# Altium schematic sheet SENSOR.SchDoc
size A; SheetNumber: 7; SheetTotal: 10
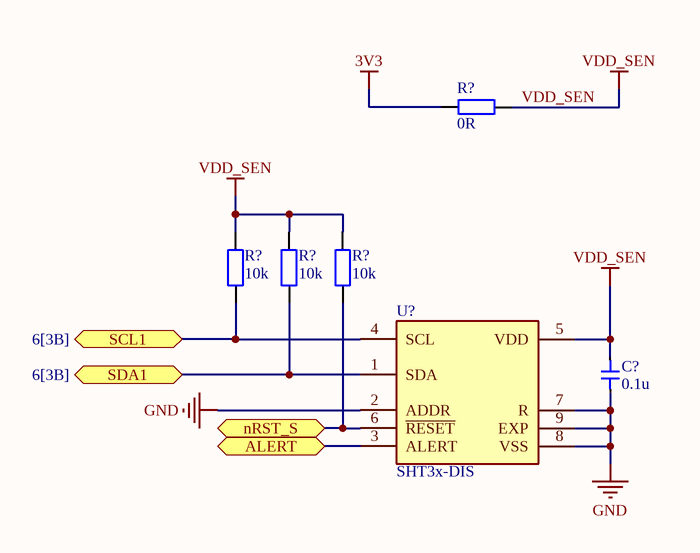
[diagram p0: SENSOR.SchDoc]

## Parts
(Parts that share a designator on the sheet are numbered #1, #2 ... from top to bottom, then left to right.)
C?  0.1u  [Cap 0603]
R?#1  0R  [tro smd 0603]
R?#2  10k  [tro smd 0603]
R?#3  10k  [tro smd 0603]
R?#4  10k  [tro smd 0603]
U?  SHT3x-DIS  [SHT3x]

## Ports
ALERT (bidir), nRST_S (bidir), SCL1 (bidir, see 6[3B]), SDA1 (bidir, see 6[3B])

## Nets
3V3: R?#1.1
GND: C?.2 U?.2(ADDR) U?.7(R) U?.8(VSS) U?.9(EXP)
VDD_SEN: C?.1 R?#1.2 R?#2.1 R?#3.1 R?#4.1 U?.5(VDD)
ALERT: U?.3(ALERT) ; port ALERT
nRST_S: R?#4.2 U?.6(~{RESET}) ; port nRST_S
SCL1: R?#2.2 U?.4(SCL) ; port SCL1
SDA1: R?#3.2 U?.1(SDA) ; port SDA1

## Library data of the parts
C? = Cap 0603: Capacitor SMD 0603
R?#1-R?#4 = Tro 0603 1% 10k: Dán; Don_Vi: Con; So_Chan: 2; Ten_Linh_Kien: Trở 0603 1% 10k; Ma_Hang: MH006333; Chung_Loai: Dán; Kieu_Chan: *
U? = SHT3x-DIS: Serial Switch/Digital Sensor, 16 Bit(s), Square, Surface Mount; Manufacturer: Sensirion; Manufacturer Part Number: SHT31-DIS-B2.5KS; Number of Bits: 16; Operating Current-Max: 1.5mA; Output Interface Type: I2C; Sensor Type: TEMPERATURE SENSOR,SWITCH/DIGITAL OUTPUT,SERIAL; Max Supply Voltage: 5.5V; Min Supply Voltage: 2.4V; Body Breadth: 2.5inch; Body Height: 0.9mm; Body Length or Diameter: 2.5mm; Supplier: Digikey; Supplier Part Number: 1649-1011-1-ND; RoHS: Yes; Category: Temperature and Humidity Sensors; Stock: 10892; Pricing: 1=5.32, 5=4.482, 10=4.164, 25=3.7784, 50=3.5112, 100=3.2631, 500=2.75274, 1000=2.55848 (USD); Mounting Technology: Surface Mount; Housing Material: Plastic; Package Shape/Style: Square; Terminal Finish: Gold; Min Operating Temperature: -40°C; Max Operating Temperature: 125°C; JESD-609 Code: e4; Termination: Solder; Reach SVHC Compliant: Yes; RoHS Compliant: Yes; ComponentLink1URL: https://datasheet.ciiva.com:443/pdfs/VipMasterIC/IC/SERI/SERI-S-A0007324878/SERI-S-A0007324878-1.pdf?src-supplier=IHS+Markit; ComponentLink1Description: https://datasheet.ciiva.com:443/pdfs/VipMasterIC/IC/SERI/SERI-S-A0007324878/SERI-S-A0007324878-1.pdf?src-supplier=IHS+Markit; ComponentLink2URL: https://media.digikey.com/pdf/Data%20Sheets/Sensirion%20PDFs/HT_DS_SHT3x_DIS.pdf?src-supplier=Digikey; ComponentLink2Description: https://media.digikey.com/pdf/Data%20Sheets/Sensirion%20PDFs/HT_DS_SHT3x_DIS.pdf?src-supplier=Digikey; ComponentLink3URL: https://datasheet.octopart.com/SHT31-DIS-B2.5KS-Sensirion-datasheet-166817248.pdf?src-supplier=Future+Electronics; ComponentLink3Description: https://datasheet.octopart.com/SHT31-DIS-B2.5KS-Sensirion-datasheet-166817248.pdf?src-supplier=Future+Electronics; ComponentLink4URL: https://datasheet.octopart.com/SHT31-DIS-B2.5KS-Sensirion-datasheet-157853116.pdf?src-supplier=SOS+electronic; ComponentLink4Description: https://datasheet.octopart.com/SHT31-DIS-B2.5KS-Sensirion-datasheet-157853116.pdf?src-supplier=SOS+electronic